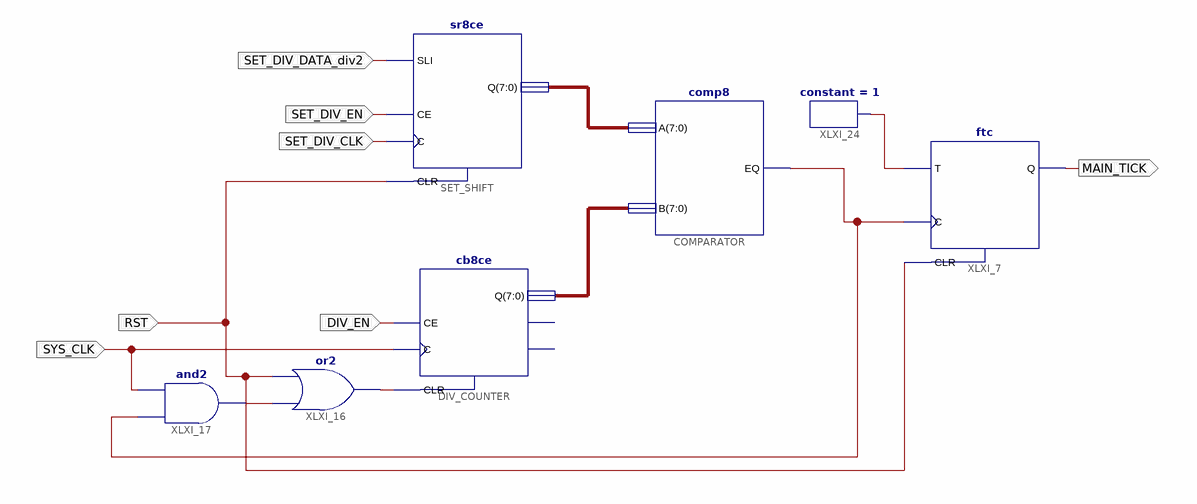
[diagram p0: schematic sheet 1]
// Xilinx ISE schematic sdc_divider.sch (spartan6) as structural Verilog: 7 symbols, 7 ports
module sdc_divider (
  input  SYS_CLK,
  input  RST,
  input  DIV_EN,
  input  SET_DIV_DATA_div2,
  input  SET_DIV_EN,
  input  SET_DIV_CLK,
  output MAIN_TICK
);

  wire XLXN_8, XLXN_12, XLXN_23, XLXN_25;
  wire [7:0] XLXN_1, XLXN_2;

  sr8ce SET_SHIFT (.C(SET_DIV_CLK), .CE(SET_DIV_EN), .CLR(RST), .SLI(SET_DIV_DATA_div2), .Q(XLXN_1));
  comp8 COMPARATOR (.A(XLXN_1), .B(XLXN_2), .EQ(XLXN_23));
  ftc XLXI_7 (.C(XLXN_23), .CLR(RST), .T(XLXN_25), .Q(MAIN_TICK));
  or XLXI_16 (XLXN_8, XLXN_12, RST);
  cb8ce DIV_COUNTER (.C(SYS_CLK), .CE(DIV_EN), .CLR(XLXN_8), .Q(XLXN_2));  // open: CEO, TC
  and XLXI_17 (XLXN_12, XLXN_23, SYS_CLK);
  constant #(.CValue("1")) XLXI_24 (.O(XLXN_25));
endmodule
